# Altium schematic sheet Dynamixel.SchDoc
size A4
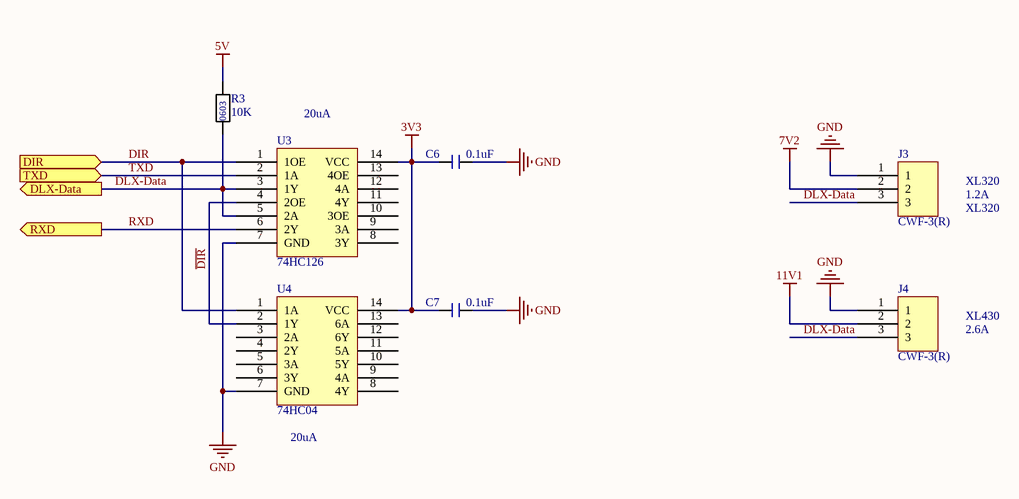
[diagram p0: Dynamixel.SchDoc]

## Parts
C6  0.1uF  [CHIP_C_0603]
C7  0.1uF  [CHIP_C_0603]
J3  CWF-3(R)  [DS1066-03]
J4  CWF-3(R)  [CWF-3]
R3  10K  [CHIP_R_0603]
U3  74HC126  [SOIC14]
U4  74HC04  [SOIC14]

## Ports
DIR (in), DLX-Data (out), RXD (out), TXD (in)

## Nets
3V3: C6.2 C7.2 U3.14(VCC) U4.14(VCC)
5V: R3.2
7V2: J3.2
11V1: J4.2
GND: C6.1 C7.1 J3.1 J4.1 U3.7(GND) U4.7(GND)
~{DIR}: U3.4(2OE) U4.2(1Y)
DIR: U3.1(1OE) U4.1(1A) ; port DIR
DLX-Data: J3.3 J4.3 R3.1 U3.3(1Y) U3.5(2A) ; port DLX-Data
RXD: U3.6(2Y) ; port RXD
TXD: U3.2(1A) ; port TXD

Not connected (* = marked no-connect by the designer): U3 8(3Y) 9(3A) 10(3OE) 11(4Y) 12(4A) 13(4OE); U4 3(2A) 4(2Y) 5(3A) 6(3Y) 8(4Y) 9(4A) 10(5Y) 11(5A) 12(6Y) 13(6A)

## Notes on the sheet
- (near U3) 20uA
- XL320
- 1.2A
- XL430
- 2.6A
- (near U4) 20uA
- (in symbol RES_0603) 0603

## Library data of the parts
C6 C7 = CHIP_C
J3 J4 = CWF-3(R): Conector
R3 = RES_0603